# EAGLE design 010 bluetooth (EAGLE 7.1.0)
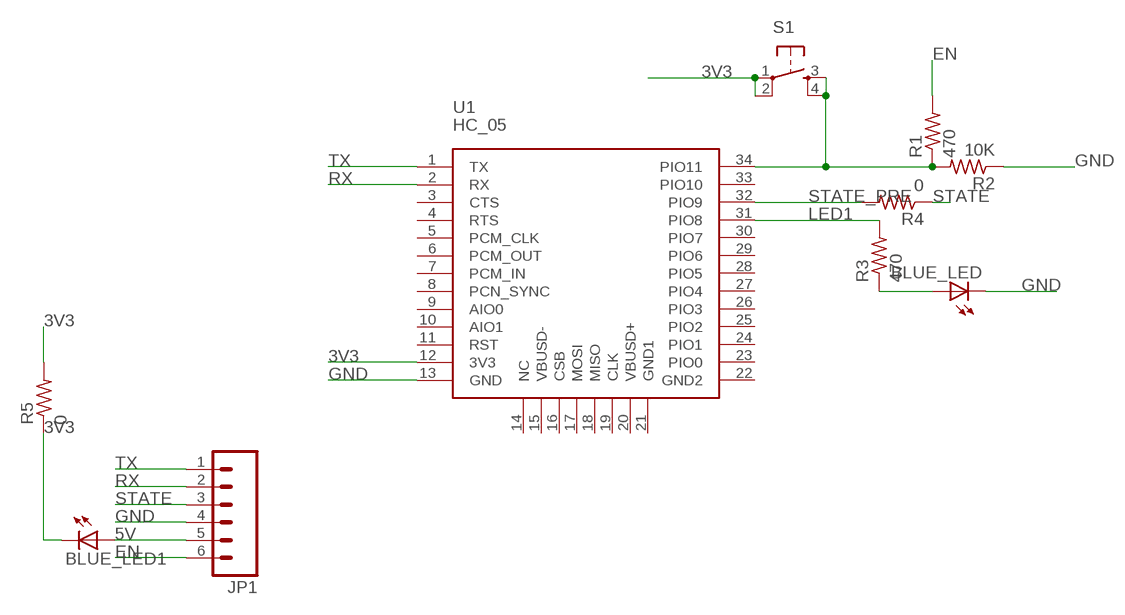
[diagram p0: schematic, sheet 1]

## Parts
BLUE_LED  LED1206  [1206]
BLUE_LED1  LED1206  [1206]
JP1  M06LONGPADS  [1X06_LONGPADS]
R1  470  RESISTOR1206  [1206]
R2  10K  RESISTOR1206  [1206]
R3  470  RESISTOR1206  [1206]
R4  0  RESISTOR1206  [1206]
R5  0  RESISTOR1206  [1206]
S1  6MM_SWITCH6MM_SWITCH  [6MM_SWITCH]
U1  HC_05  [BLUETOOTH_SMD]

## Nets
3V3: BLUE_LED1.2(C) R5.1 R5.2 S1.1(P) S1.2(P1) U1.12(3V3)
5V: BLUE_LED1.1(A) JP1.5
EN: JP1.6 R1.2
GND: BLUE_LED.2(C) JP1.4 R2.1 U1.13(GND)
LED1: R3.2 U1.31(PIO8)
N$1: R1.1 R2.2 S1.3(S) S1.4(S1) U1.34(PIO11)
N$2: BLUE_LED.1(A) R3.1
RX: JP1.2 U1.2(RX)
STATE: JP1.3 R4.1
STATE_PRE: R4.2 U1.32(PIO9)
TX: JP1.1 U1.1(TX)
Unconnected: U1.3(CTS) U1.4(RTS) U1.5(PCM_CLK) U1.6(PCM_OUT) U1.7(PCM_IN) U1.8(PCN_SYNC) U1.9(AIO0) U1.10(AIO1) U1.11(RST) U1.14(NC) U1.15(VBUSD-) U1.16(CSB) U1.17(MOSI) U1.18(MISO) U1.19(CLK) U1.20(VBUSD+) U1.21(GND1) U1.22(GND2) U1.23(PIO0) U1.24(PIO1) U1.25(PIO2) U1.26(PIO3) U1.27(PIO4) U1.28(PIO5) U1.29(PIO6) U1.30(PIO7) U1.33(PIO10)

## Library data of the parts
BLUE_LED BLUE_LED1 = 01_FAB_Hello:LED
JP1 = 01_SparkFun:M06: Header 6 Standard 6-pin 0.1" header. Use with straight break away headers (SKU : PRT-00116), right angle break away headers (PRT-00553), swiss pins (PRT-00743), machine pins (PRT-00117), and female headers (PRT-00115). Molex polarized connector foot print use with SKU : PRT-08094 with associated crimp pins and housings. NOTES ON THE VARIANTS LOCK and LOCK_LONGPADS... This footprint was designed to help hold the alignment of a through-hole component (i.e. 6-pin header) while soldering it into place. You may notice that each hole has been shifted either up or down by 0.005 of an inch from it's more standard position (which is a perfectly straight line). This slight alteration caused the pins (the squares in the middle) to touch the edges of the holes. Because they are alternating, it causes a "brace" to hold the component in place. 0.005 has proven to be the perfect amount of "off-center" position when using our standard breakaway headers. Although looks a little odd when you look at the bare footprint, once you have a header in there, the alteration is very hard to notice. Also, if you push a header all the way into place, it is covered up entirely on the bottom side. This idea of altering the position of holes to aid alignment will be further integrated into the Sparkfun Library for other footprints. It can help hold any component with 3 or more connection pins.
R1-R5 = 01_FAB_Hello:RESISTOR
S1 = 01_FAB_Hello:6MM_SWITCH: OMRON SWITCH
U1 = Bluetooth%20HC-05:HC_05: HC-05 Bluetooth Module

## Board
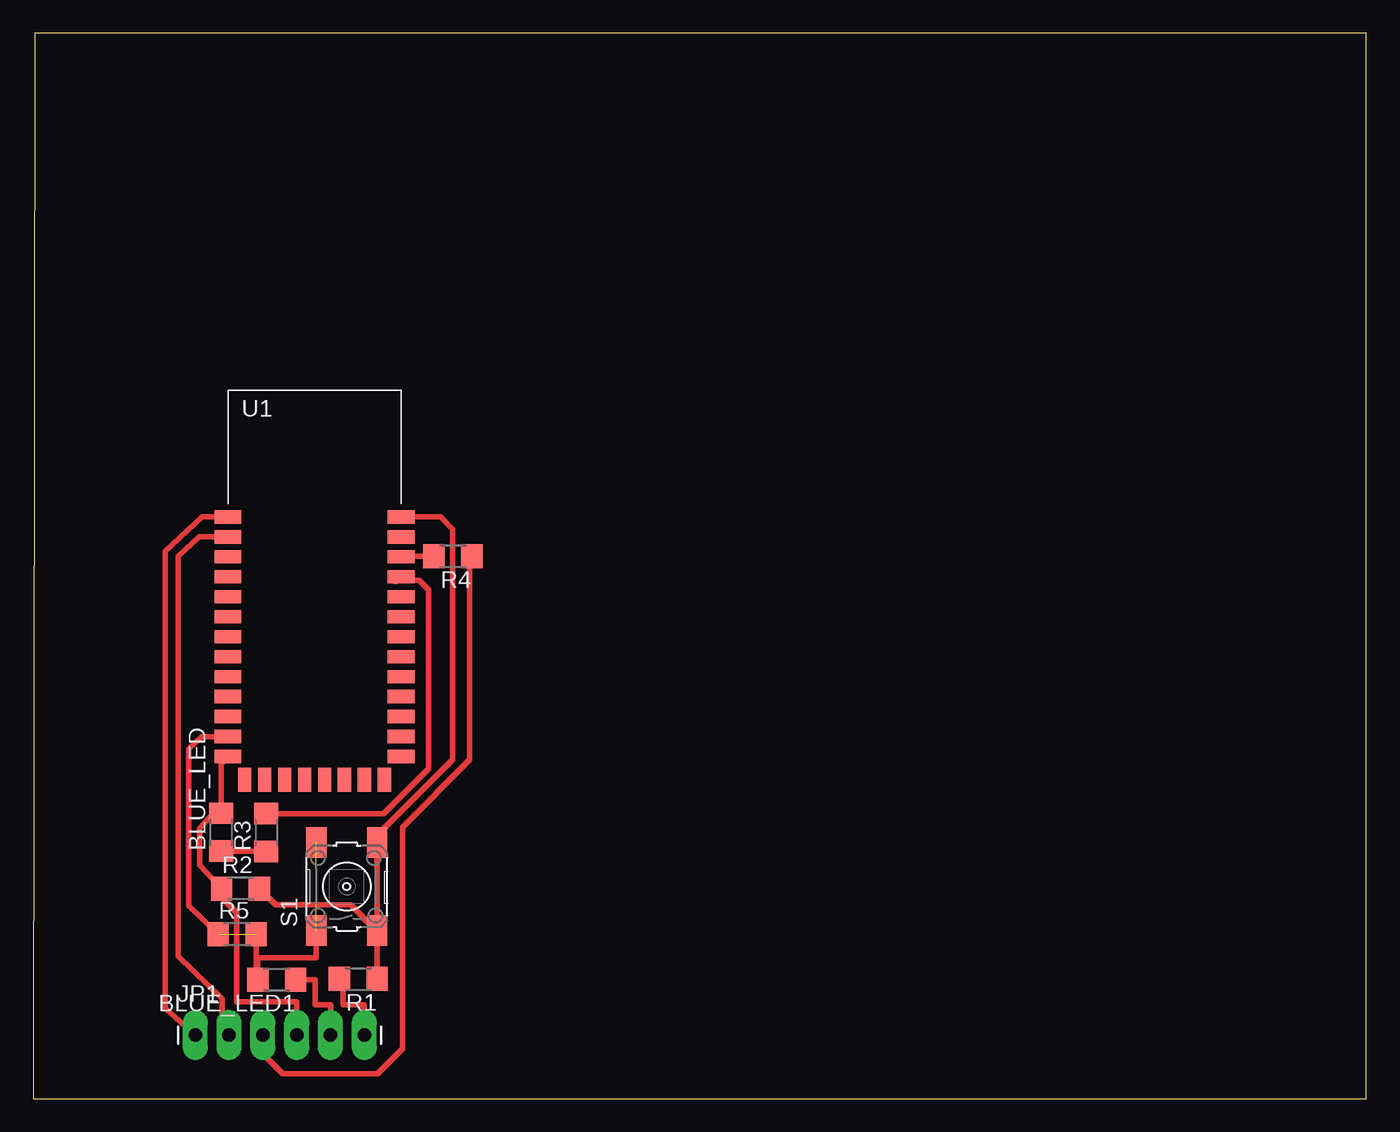
[diagram p1: board, top side]

Size 100.13 x 80 mm. Coordinates in mm from the lower left corner, seen from the top.
Outline: 0,0 100.13,0 100.13,80 0.13,80 0,0
Copper layers (1*16): Top 0.035mm / dielectric 1.5mm / Bottom 0.035mm
Design rules "default": minimum track width 15mil, minimum drill 24mil, track to track 15mil, track to pad 15mil, pad to pad 15mil, via to via 15mil, smd to smd 15mil, copper to edge 40mil, drill to drill 8mil, minimum pad ring 10mil, minimum via ring 8mil, stop-mask expansion 4mil, vias tented up to drill 0mil, thermal gap 10mil

### Footprints (pad centres in the part's own frame; a part is rotated, then mirrored left to right if it is on the bottom)
1206 = smd 1.6 x 1.803: 1 -1.422,0; 2 1.422,0
1X06_LONGPADS = drill 1.016 pad 1.88 long: 1 0,0; 2 2.54,0; 3 5.08,0; 4 7.62,0; 5 10.16,0; 6 12.7,0
6MM_SWITCH = smd 2.286 x 1.524: 1 -3.302,2.286; 2 3.302,2.286; 3 -3.302,-2.286; 4 3.302,-2.286
BLUETOOTH_SMD = smd 2 x 1: 1 -6.35,3.81; 2 -6.35,2.31; 3 -6.35,0.81; 4 -6.35,-0.69; 5 -6.35,-2.19; 6 -6.35,-3.69; 7 -6.35,-5.19; 8 -6.35,-6.69; 9 -6.35,-8.19; 10 -6.35,-9.69; 11 -6.35,-11.19; 12 -6.35,-12.69; 13 -6.35,-14.19; 22 6.65,-14.19; 23 6.65,-12.69; 24 6.65,-11.19; 25 6.65,-9.69; 26 6.65,-8.19; 27 6.65,-6.69; 28 6.65,-5.19; 29 6.65,-3.69; 30 6.65,-2.19; 31 6.65,-0.69; 32 6.65,0.81; 33 6.65,2.31; 34 6.65,3.81 | smd 1 x 1.8: 14 -5.1,-15.94; 15 -3.6,-15.94; 16 -2.1,-15.94; 17 -0.6,-15.94; 18 0.9,-15.94; 19 2.4,-15.94; 20 3.9,-15.94; 21 5.4,-15.94

### Placement (x,y rotation side)
BLUE_LED  14.1,20.02 90 top
BLUE_LED1  18.29,8.94 180 top
JP1  12.17,4.78 0 top
R1  24.41,8.99 180 top
R2  15.57,15.77 0 top
R3  17.5,19.99 90 top
R4  31.52,40.74 180 top
R5  15.32,12.34 0 top
S1  23.55,15.93 90 top
U1  20.98,39.88 0 top

### Tracks (layer width: path | path; a pad name or v marks a point on that pad's centre or on a via)
3V3  (3 unrouted)
  Top 0.406: 21.23,12.62 21.23,10.57 16.87,10.57 BLUE_LED1.2 16.74,9.07 R5.2 | R5.1 11.68,14.5 11.68,26.26 12.65,27.18 14.62,27.18 U1.12
5V
  Top 0.406: JP1.5 22.33,7.04 21.16,7.04 21.16,8.94 BLUE_LED1.1
EN
  Top 0.406: JP1.6 24.87,7.04 23.27,7.04 23.27,8.99 R1.2
GND
  Top 0.406: JP1.4 19.79,7.26 15.29,7.26 15.29,13.95 14.15,15.09 R2.1 12.5,17.53 12.5,20.32 13.51,21.44 BLUE_LED.2 14.1,25.16 U1.13
LED1
  Top 0.406: R3.2 26.31,21.41 29.69,24.79 29.69,38.23 28.98,38.94 27.18,38.94 27.1,38.86 27.3,38.86 U1.31
N$1
  Top 0.406: R1.1 S1.3 | U1.34 27.66,43.71 27.68,43.69 30.58,43.69 31.5,42.77 31.5,25.45 25.83,19.79 S1.4 25.73,18.95 25.83,18.95 S1.3 | R2.2 18.21,14.55 23.82,14.55 25.76,12.62 S1.3
N$2
  Top 0.406: R3.1 14.12,18.57 BLUE_LED.1
RX
  Top 0.406: JP1.2 14.2,5.28 14.2,7.52 10.87,10.69 10.87,40.72 12.45,42.19 U1.2
STATE
  Top 0.406: JP1.3 17.17,4.78 17.17,3.45 18.74,1.88 25.86,1.88 27.74,3.76 27.74,20.4 32.79,25.45 32.79,40.59 R4.1
STATE_PRE
  Top 0.406: U1.32 27.68,40.74 R4.2
TX
  Top 0.406: JP1.1 9.91,6.81 9.91,41.12 12.7,43.69 U1.1